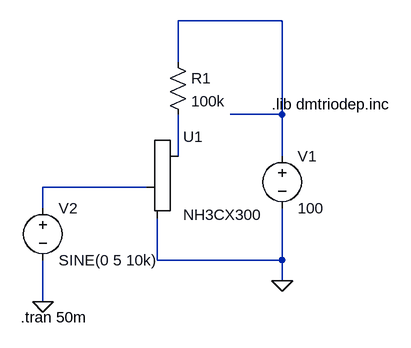
[diagram p0: schematic TubeTest00.asc]
TubeTest00.asc, the LTspice schematic file:
Version 4
SHEET 1 880 680
WIRE 272 -96 112 -96
WIRE 112 -32 112 -96
WIRE 272 48 272 -96
WIRE 272 48 192 48
WIRE 112 112 112 48
WIRE 272 112 272 48
WIRE 64 160 -96 160
WIRE -96 192 -96 160
WIRE 80 272 80 208
WIRE 272 272 272 192
WIRE 272 272 80 272
WIRE 272 304 272 272
WIRE -96 336 -96 272
FLAG -96 336 0
FLAG 272 304 0
SYMBOL Misc\\triode 112 160 R0
SYMATTR InstName U1
SYMATTR Value NH3CX300
SYMBOL voltage 272 96 R0
WINDOW 123 0 0 Left 0
WINDOW 39 0 0 Left 0
SYMATTR InstName V1
SYMATTR Value 100
SYMBOL res 96 -48 R0
SYMATTR InstName R1
SYMATTR Value 100k
SYMATTR SpiceLine tol=100k
SYMBOL voltage -96 176 R0
WINDOW 123 0 0 Left 0
WINDOW 39 0 0 Left 0
SYMATTR InstName V2
SYMATTR Value SINE(0 5 10k)
TEXT 256 32 Left 2 !.lib dmtriodep.inc
TEXT -130 360 Left 2 !.tran 50m

The netlist it stands for:
* TubeTest00.asc
XU1 N002 N003 0 NH3CX300
V1 N001 0 100
R1 N001 N002 100k tol=100k
V2 N003 0 SINE(0 5 10k)
.lib dmtriodep.inc
.tran 50m
.backanno
.end